# EAGLE design snowflake-r1 (EAGLE 5.12)
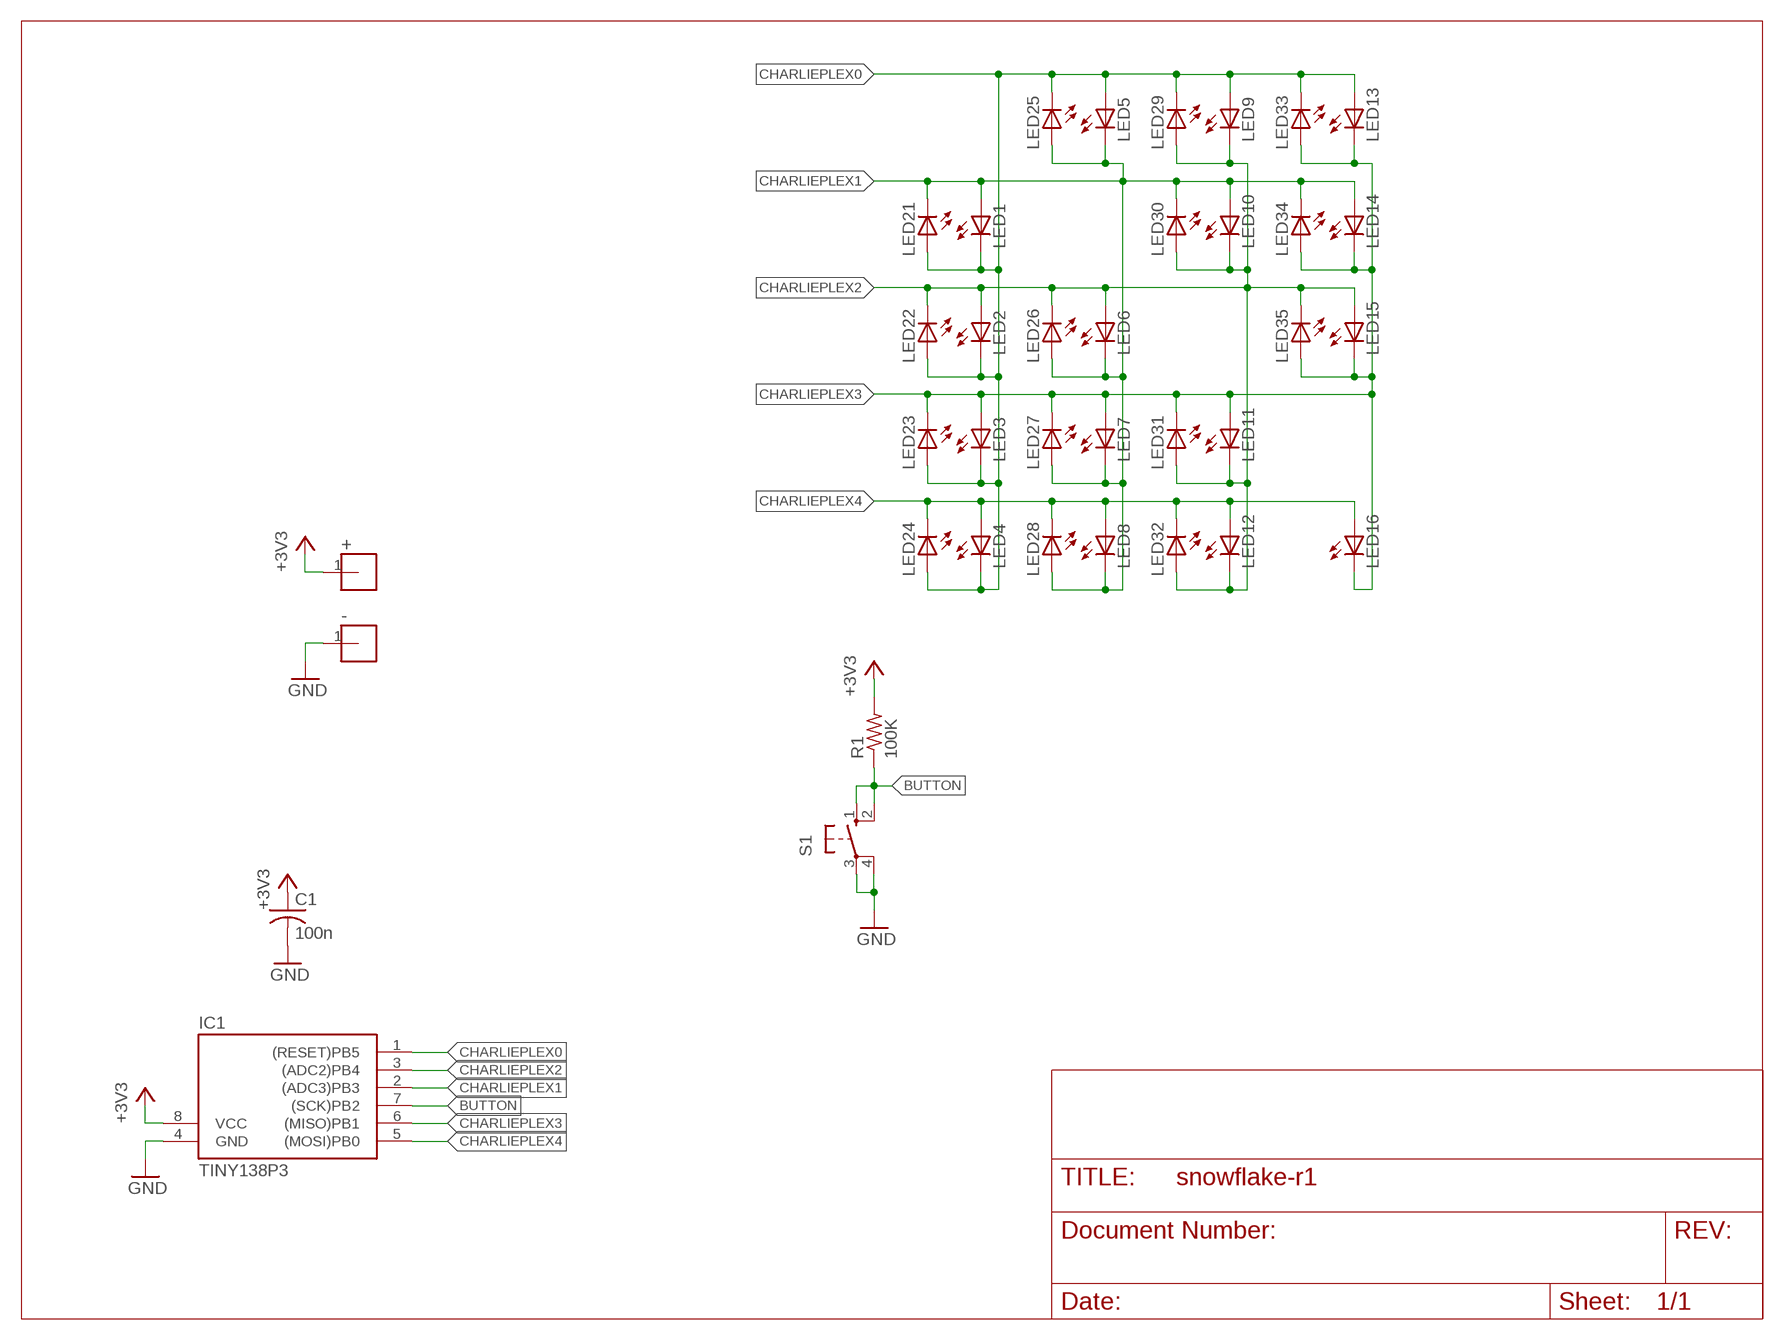
[diagram p0: schematic, sheet 1]

## Parts
+  M01-100MIL  [100MIL-1]
-  M01-100MIL  [100MIL-1]
C1  100n  C-US025-025X050  [C025-025X050]
IC1  TINY138P3  [DIL08]
LED1  LED3MM  [LED3MM]
LED2  LED3MM  [LED3MM]
LED3  LED3MM  [LED3MM]
LED4  LED3MM  [LED3MM]
LED5  LED3MM  [LED3MM]
LED6  LED3MM  [LED3MM]
LED7  LED3MM  [LED3MM]
LED8  LED3MM  [LED3MM]
LED9  LED3MM  [LED3MM]
LED10  LED3MM  [LED3MM]
LED11  LED3MM  [LED3MM]
LED12  LED3MM  [LED3MM]
LED13  LED3MM  [LED3MM]
LED14  LED3MM  [LED3MM]
LED15  LED3MM  [LED3MM]
LED16  LED3MM  [LED3MM]
LED21  LED3MM  [LED3MM]
LED22  LED3MM  [LED3MM]
LED23  LED3MM  [LED3MM]
LED24  LED3MM  [LED3MM]
LED25  LED3MM  [LED3MM]
LED26  LED3MM  [LED3MM]
LED27  LED3MM  [LED3MM]
LED28  LED3MM  [LED3MM]
LED29  LED3MM  [LED3MM]
LED30  LED3MM  [LED3MM]
LED31  LED3MM  [LED3MM]
LED32  LED3MM  [LED3MM]
LED33  LED3MM  [LED3MM]
LED34  LED3MM  [LED3MM]
LED35  LED3MM  [LED3MM]
R1  100K  R-US_0207/10  [0207/10]
S1  10-XX  [B3F-10XX]

## Nets
+3V3: +.1 C1.1 IC1.8(VCC) R1.2
BUTTON: IC1.7((SCK)PB2) R1.1 S1.1(S) S1.2(S1)
CHARLIEPLEX0: IC1.1((RESET)PB5) LED1.K(C) LED2.K(C) LED3.K(C) LED4.K(C) LED5.A LED9.A LED13.A LED21.A LED22.A LED23.A LED24.A LED25.K(C) LED29.K(C) LED33.K(C)
CHARLIEPLEX1: IC1.2((ADC3)PB3) LED1.A LED5.K(C) LED6.K(C) LED7.K(C) LED8.K(C) LED10.A LED14.A LED21.K(C) LED25.A LED26.A LED27.A LED28.A LED30.K(C) LED34.K(C)
CHARLIEPLEX2: IC1.3((ADC2)PB4) LED2.A LED6.A LED9.K(C) LED10.K(C) LED11.K(C) LED12.K(C) LED15.A LED22.K(C) LED26.K(C) LED29.A LED30.A LED31.A LED32.A LED35.K(C)
CHARLIEPLEX3: IC1.6((MISO)PB1) LED3.A LED7.A LED11.A LED13.K(C) LED14.K(C) LED15.K(C) LED16.K(C) LED23.K(C) LED27.K(C) LED31.K(C) LED33.A LED34.A LED35.A
CHARLIEPLEX4: IC1.5((MOSI)PB0) LED4.A LED8.A LED12.A LED16.A LED24.K(C) LED28.K(C) LED32.K(C)
GND: -.1 C1.2 IC1.4(GND) S1.3(P) S1.4(P1)

## Library data of the parts
+ - = rbg-generic-headers:M01-100MIL
C1 = rcl:C-US: CAPACITOR, American symbol
IC1 = avr-5:TINY13*
LED1-LED16 LED21-LED35 = led:LED: LED OSRAM: - CHIPLED LG R971, LG N971, LY N971, LG Q971, LY Q971, LO R971, LY R971 LH N974, LH R974 LS Q976, LO Q976, LY Q976 LO Q996 - Hyper CHIPLED LW Q18S LB Q993, LB Q99A, LB R99A - SideLED LS A670, LO A670, LY A670, LG A670, LP A670 LB A673, LV A673, LT A673, LW A673 LH A674 LY A675 LS A676, LA A676, LO A676, LY A676, LW A676 LS A679, LY A679, LG A679 - Hyper Micro SIDELED® LS Y876, LA Y876, LO Y876, LY Y876 LT Y87S - SmartLED LW L88C, LW L88S LB L89C, LB L89S, LG L890 LS L89K, LO L89K, LY L89K LS L896, LA L896, LO L896, LY L896 - TOPLED LS T670, LO T670, LY T670, LG T670, LP T670 LSG T670, LSP T670, LSY T670, LOP T670, LYG T670 LG T671, LOG T671, LSG T671 LB T673, LV T673, LT T673, LW T673 LH T674 LS T676, LA T676, LO T676, LY T676, LB T676, LH T676, LSB T676, LW T676 LB T67C, LV T67C, LT T67C, LS T67K, LO T67K, LY T67K, LW E67C LS E67B, LA E67B, LO E67B, LY E67B, LB E67C, LV E67C, LT E67C LW T67C LS T679, LY T679, LG T679 LS T770, LO T770, LY T770, LG T770, LP T770 LB T773, LV T773, LT T773, LW T773 LH T774 LS E675, LA E675, LY E675, LS T675 LS T776, LA T776, LO T776, LY T776, LB T776 LHGB T686 LT T68C, LB T68C - Hyper Mini TOPLED® LB M676 - Mini TOPLED Santana® LG M470 LS M47K, LO M47K, LY M47K Source: http://www.osram.convergy.de LUXEON: - LUMILED® LXK2-PW12-R00, LXK2-PW12-S00, LXK2-PW14-U00, LXK2-PW14-V00 LXK2-PM12-R00, LXK2-PM12-S00, LXK2-PM14-U00 LXK2-PE12-Q00, LXK2-PE12-R00, LXK2-PE12-S00, LXK2-PE14-T00, LXK2-PE14-U00 LXK2-PB12-K00, LXK2-PB12-L00, LXK2-PB12-M00, LXK2-PB14-N00, LXK2-PB14-P00, LXK2-PB14-Q00 LXK2-PR12-L00, LXK2-PR12-M00, LXK2-PR14-Q00, LXK2-PR14-R00 LXK2-PD12-Q00, LXK2-PD12-R00, LXK2-PD12-S00 LXK2-PH12-R00, LXK2-PH12-S00 LXK2-PL12-P00, LXK2-PL12-Q00, LXK2-PL12-R00 Source: www.luxeon.com KINGBRIGHT: KA-3528ASYC Source: www.kingbright.com
R1 = rcl:R-US_: RESISTOR, American symbol
S1 = rbg-generic-tact-switch:10-XX: OMRON SWITCH

## Board
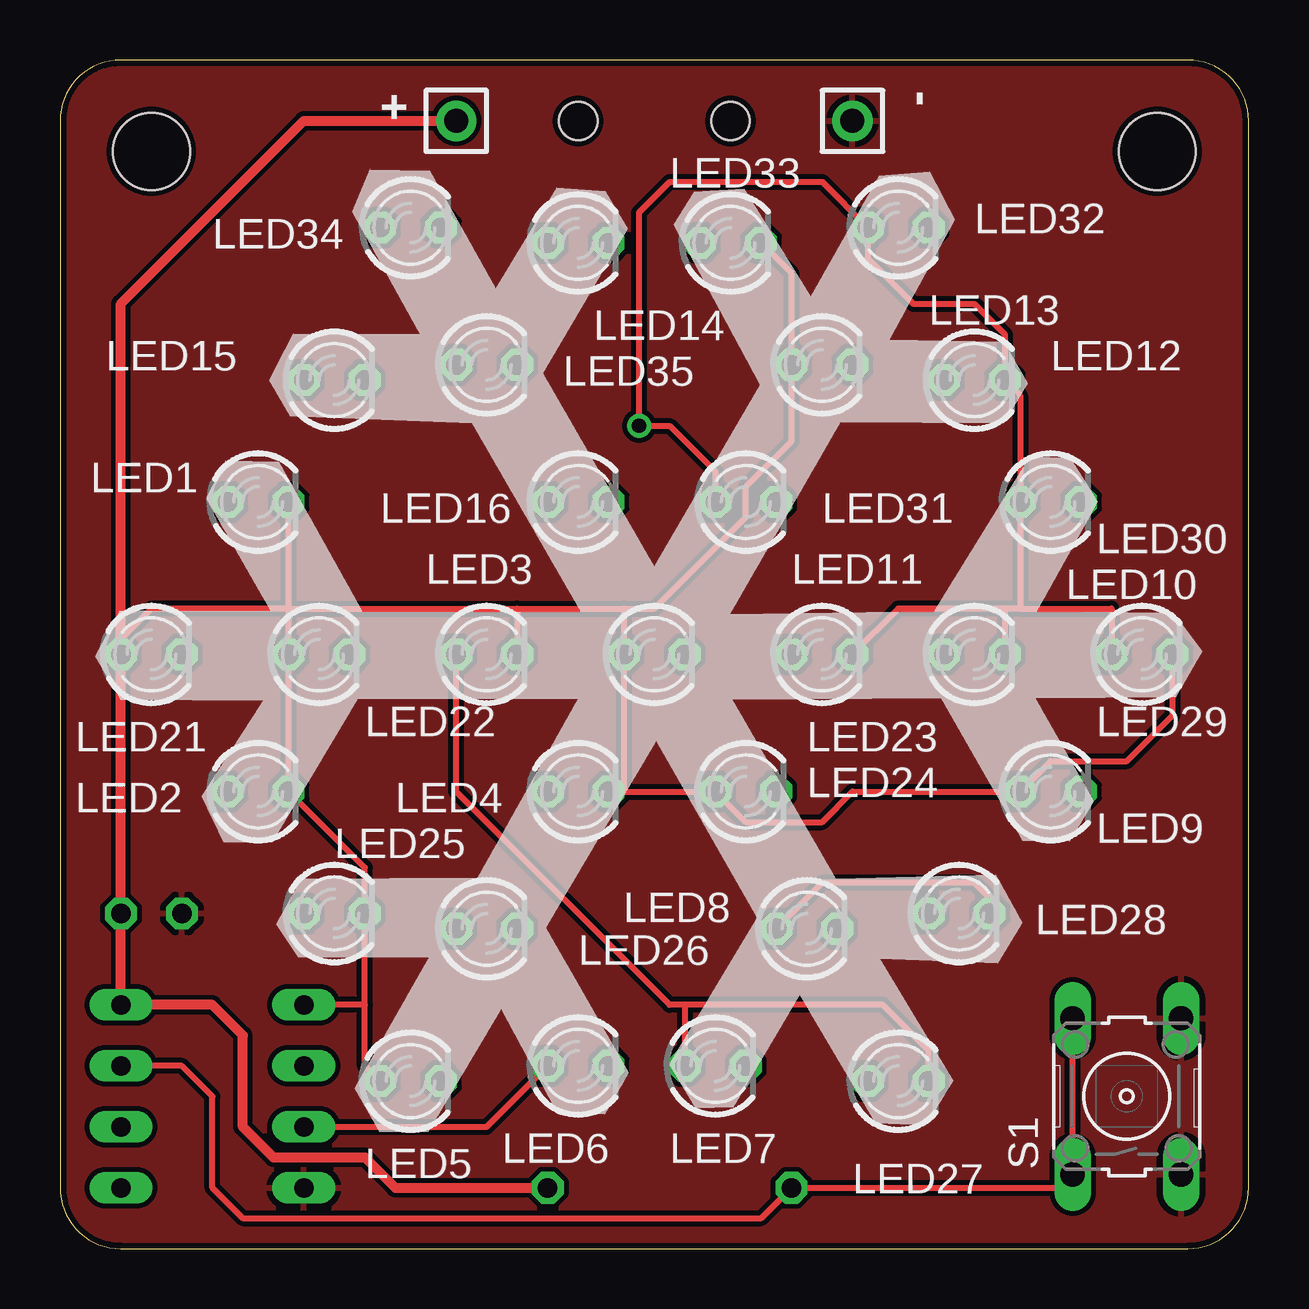
[diagram p1: board, top side]
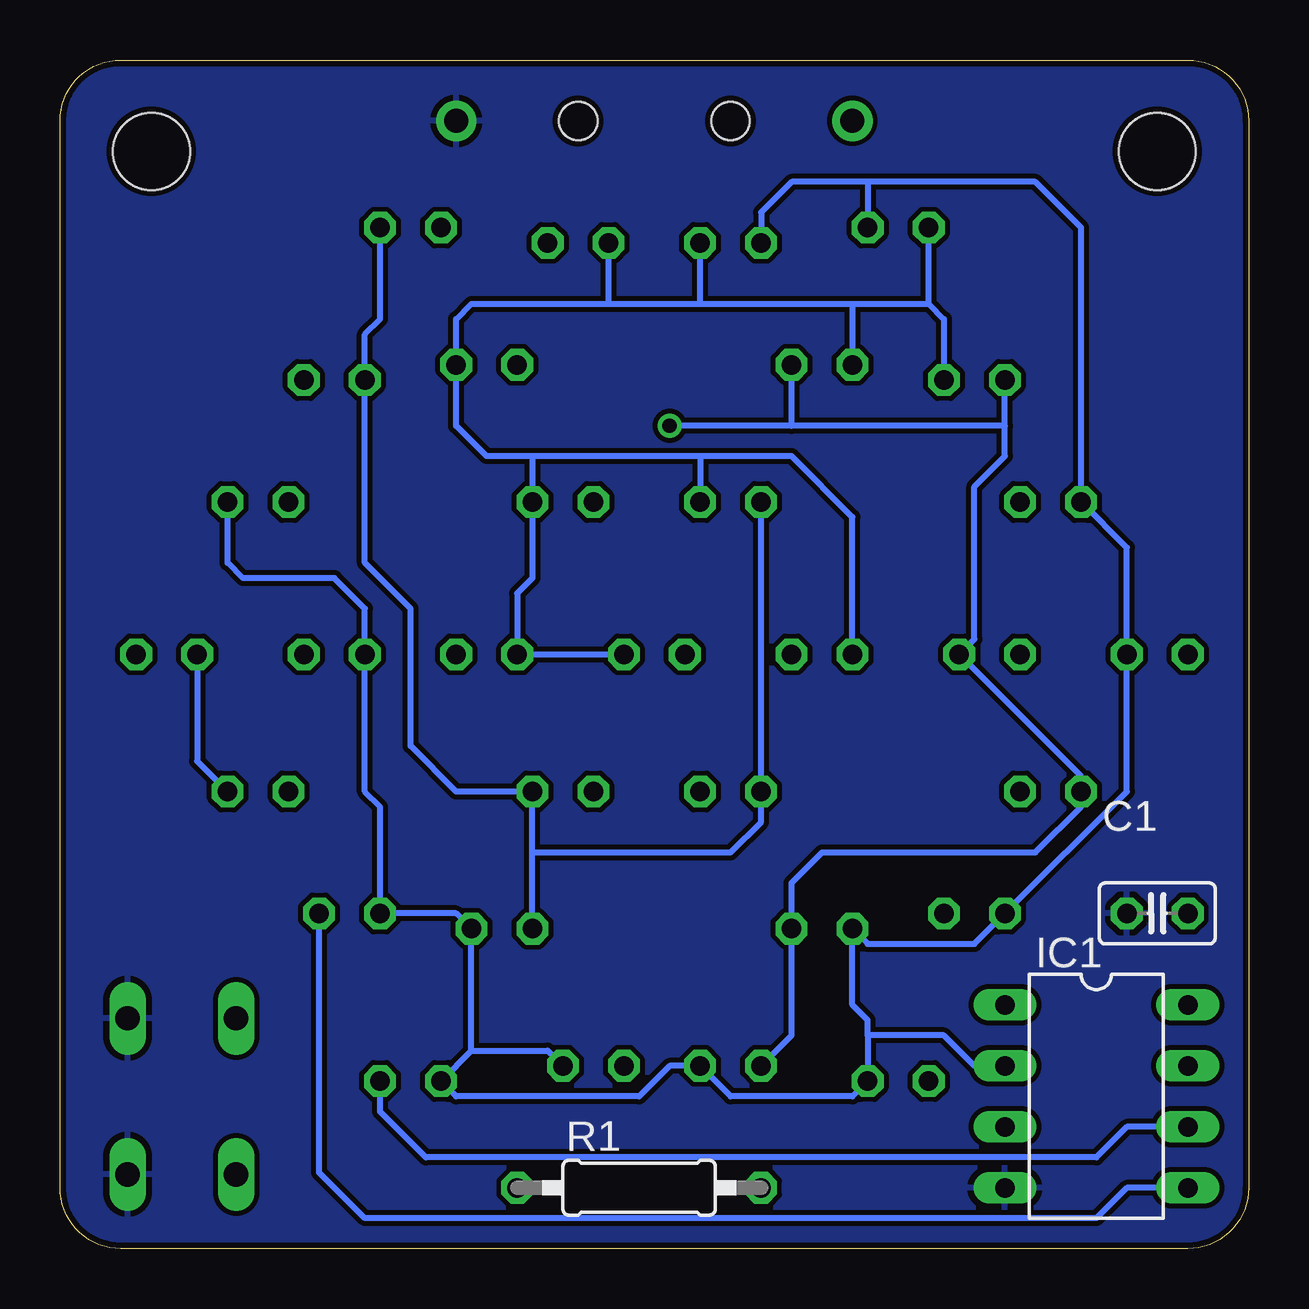
[diagram p2: board, bottom side, seen from below]

Size 49.53 x 49.53 mm. Coordinates in mm from the lower left corner, seen from the top.
Outline: 46.99,0 arc90 49.53,2.54 49.53,46.99 arc90 46.99,49.53 2.54,49.53 arc90 0,46.99 0,2.54 arc90 2.54,0 46.99,0
Copper layers (1*16): Top 0.035mm / dielectric 1.5mm / Bottom 0.035mm
Design rules "default *": minimum track width 10mil, minimum drill 0.6mm, track to track 8mil, track to pad 8mil, pad to pad 8mil, via to via 8mil, smd to smd 8mil, copper to edge 10mil, drill to drill 8mil, minimum pad ring 10mil, minimum via ring 8mil, stop-mask expansion 4mil, vias tented up to drill 0mil, thermal gap 10mil
Holes 3.2 mm at 3.81,45.72 45.72,45.72
Holes 1.6 mm at 21.59,46.99 27.94,46.99

### Footprints (pad centres in the part's own frame; a part is rotated, then mirrored left to right if it is on the bottom)
100MIL-1 = drill 1 pad 1.676 round: 1 0,0
C025-025X050 = drill 0.813 octagon: 1 -1.27,0; 2 1.27,0
DIL08 = drill 0.813 long: 1 -3.81,-3.81; 2 -1.27,-3.81; 3 1.27,-3.81; 4 3.81,-3.81; 5 3.81,3.81; 6 1.27,3.81; 7 -1.27,3.81; 8 -3.81,3.81
LED3MM = drill 0.813 octagon: A -1.27,0; K 1.27,0
0207/10 = drill 0.813 octagon: 1 -5.08,0; 2 5.08,0
B3F-10XX = drill 1.016 long: 1 -3.251,2.261; 2 3.251,2.261; 3 -3.251,-2.261; 4 3.251,-2.261

### Placement (x,y rotation side)
+  16.51,46.99 90 top
-  33.02,46.99 270 top
C1  3.81,13.97 180 bottom
IC1  6.35,6.35 270 bottom
LED1  8.26,31.11 0 top
LED2  8.26,19.05 0 top
LED3  17.78,24.77 0 top
LED4  21.59,19.05 0 top
LED5  14.61,6.99 0 top
LED6  21.59,7.62 0 top
LED7  27.3,7.62 0 top
LED8  31.11,13.34 0 top
LED9  41.27,19.05 0 top
LED10  38.1,24.77 0 top
LED11  31.75,24.77 0 top
LED12  38.1,36.2 0 top
LED13  31.75,36.83 0 top
LED14  21.59,41.91 0 top
LED15  11.43,36.2 0 top
LED16  21.59,31.11 0 top
LED21  3.81,24.77 0 top
LED22  10.79,24.77 0 top
LED23  24.77,24.77 0 top
LED24  28.57,19.05 0 top
LED25  11.43,13.97 0 top
LED26  17.78,13.34 0 top
LED27  34.92,6.99 0 top
LED28  37.47,13.97 0 top
LED29  45.09,24.77 0 top
LED30  41.27,31.11 0 top
LED31  28.57,31.11 0 top
LED32  34.92,42.55 0 top
LED33  27.94,41.91 0 top
LED34  14.61,42.55 0 top
LED35  17.78,36.83 0 top
R1  25.4,2.54 0 bottom
S1  44.45,6.35 90 top

### Tracks (layer width: path | path; a pad name or v marks a point on that pad's centre or on a via)
+3V3
  Top 0.406: R1.2 13.97,2.54 12.7,3.81 8.89,3.81 7.62,5.08 7.62,8.89 6.35,10.16 IC1.8 C1.1 2.54,39.37 10.16,46.99 +.1
BUTTON
  Top 0.254: S1.2 S1.1 41.63,2.54 R1.1 29.21,1.27 7.62,1.27 6.35,2.54 6.35,6.35 5.08,7.62 IC1.7
CHARLIEPLEX0
  Top 0.254: 9.53,26.67 LED22.A LED2.K 12.7,15.88 LED25.K 12.7,10.16 | 9.53,26.67 LED1.K | LED21.A 2.54,25.4 3.81,26.67 9.53,26.67 | 19.05,26.67 LED3.K | 9.53,26.67 19.05,26.67 | 23.5,26.67 LED23.A 23.5,19.05 | 19.05,26.67 23.5,26.67 | 23.5,26.67 24.77,26.67 28.57,30.48 28.57,31.75 30.48,33.66 LED13.A 30.48,40.64 LED33.K | 23.5,19.05 LED4.K | 23.5,19.05 LED24.A 28.57,17.78 31.75,17.78 33.02,19.05 LED9.A 41.27,20.32 44.45,20.32 46.35,22.23 LED29.K | LED5.A 12.7,7.62 12.7,10.16 | 12.7,10.16 IC1.1
CHARLIEPLEX1
  Bottom 0.254: 15.88,8.89 LED5.K 16.51,6.35 21.59,6.35 LED6.K 24.13,7.62 25.4,6.35 33.02,6.35 LED27.A 32.38,8.26 | 15.88,8.89 15.88,9.53 16.51,10.16 LED26.A 15.88,12.7 11.43,12.7 LED25.A 5.08,19.05 LED21.K 5.08,29.21 LED1.A 6.99,42.55 8.89,44.45 15.88,44.45 | 32.38,8.26 29.21,8.26 LED7.K | 32.38,8.26 LED8.K 33.02,13.97 LED28.A 36.2,18.41 36.83,19.05 LED10.A 36.83,26.67 38.1,27.94 41.91,27.94 42.55,28.57 LED30.K | 15.88,44.45 19.05,44.45 20.32,43.18 LED14.A | 15.88,44.45 LED34.K | IC1.2 11.43,7.62 12.7,8.89 15.88,8.89
CHARLIEPLEX2  (via drill 0.6)
  Top 0.254: LED29.A 43.81,26.67 40.01,26.67 | 40.01,26.67 39.37,26.67 | 40.01,26.67 LED30.A 40.01,35.56 LED12.K 39.37,38.1 38.1,39.37 35.56,39.37 33.66,41.27 LED32.A 31.75,44.45 25.4,44.45 24.13,43.18 v24.13,34.29 25.4,34.29 27.3,32.38 LED31.A | 39.37,26.67 LED10.K | 39.37,26.67 34.92,26.67 LED11.K | IC1.3 17.78,5.08 LED6.A
  Bottom 0.254: LED9.K 43.81,20.32 LED29.A | 19.05,34.29 LED35.K | 10.16,34.29 19.05,34.29 | 10.16,34.29 10.16,33.02 11.43,31.75 11.43,25.4 LED22.K 6.99,19.68 LED2.A 6.99,18.41 8.89,16.51 17.78,16.51 19.05,15.24 LED26.K 19.05,8.89 LED6.A | 10.16,34.29 LED15.A | 19.05,34.29 v24.13,34.29
CHARLIEPLEX3
  Top 0.254: LED27.K 36.2,8.26 34.29,10.16 26.04,10.16 | 26.04,10.16 25.4,10.16 16.51,19.05 LED3.A | 26.04,10.16 LED7.A
  Bottom 0.254: LED3.A 16.51,30.48 19.05,33.02 22.86,33.02 | 22.86,33.02 29.84,33.02 | 29.84,33.02 31.75,33.02 33.02,34.29 LED13.K 33.02,38.73 32.38,39.37 26.67,39.37 | 29.84,33.02 LED31.K 29.84,27.94 30.48,27.3 LED11.A LED23.K | 22.86,33.02 LED16.K | LED15.K 12.7,38.73 13.34,39.37 | 26.67,39.37 22.86,39.37 | 22.86,39.37 16.51,39.37 | 16.51,39.37 13.34,39.37 | 26.67,39.37 LED33.A | 22.86,39.37 LED14.K | 13.34,39.37 LED34.A | 16.51,39.37 LED35.A | IC1.6 5.08,5.08 6.35,3.81 34.29,3.81 36.2,5.71 LED27.K
CHARLIEPLEX4
  Top 0.254: LED28.K 38.73,14.61 38.1,15.24 31.75,15.24 LED8.A
  Bottom 0.254: LED32.K 36.2,38.73 36.83,38.1 LED12.A 36.83,28.57 34.92,26.67 34.92,20.95 33.02,19.05 LED24.K 29.84,16.51 | LED16.A LED4.A 20.32,17.78 21.59,16.51 29.84,16.51 | LED8.A 29.84,16.51 | IC1.5 5.08,2.54 6.35,1.27 36.83,1.27 38.73,3.17 LED28.K
GND
  pour Top: -1.27,50.8 50.8,50.8 50.8,-1.27 -1.27,-1.27
  pour Bottom: -1.27,50.8 50.8,50.8 50.8,-1.27 -1.27,-1.27